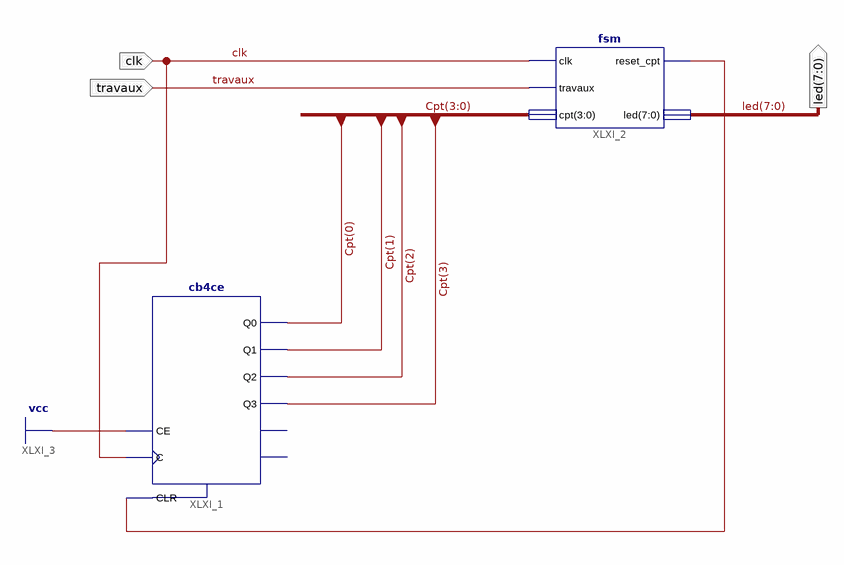
[diagram p0: schematic sheet 1]
// Xilinx ISE schematic controleur.sch (spartan3e) as structural Verilog: 2 symbols, 3 ports
module controleur (
  input  clk,
  input  travaux,
  output [7:0] led
);

  wire XLXN_1;
  wire [3:0] Cpt;

  cb4ce XLXI_1 (.C(clk), .CE(1'b1), .CLR(XLXN_1), .Q0(Cpt[0]), .Q1(Cpt[1]), .Q2(Cpt[2]), .Q3(Cpt[3]));  // open: CEO, TC
  fsm XLXI_2 (.clk(clk), .travaux(travaux), .cpt(Cpt), .reset_cpt(XLXN_1), .led(led));
endmodule
